# Altium schematic sheet Sheetpan(2)(2).SchDoc
size A2
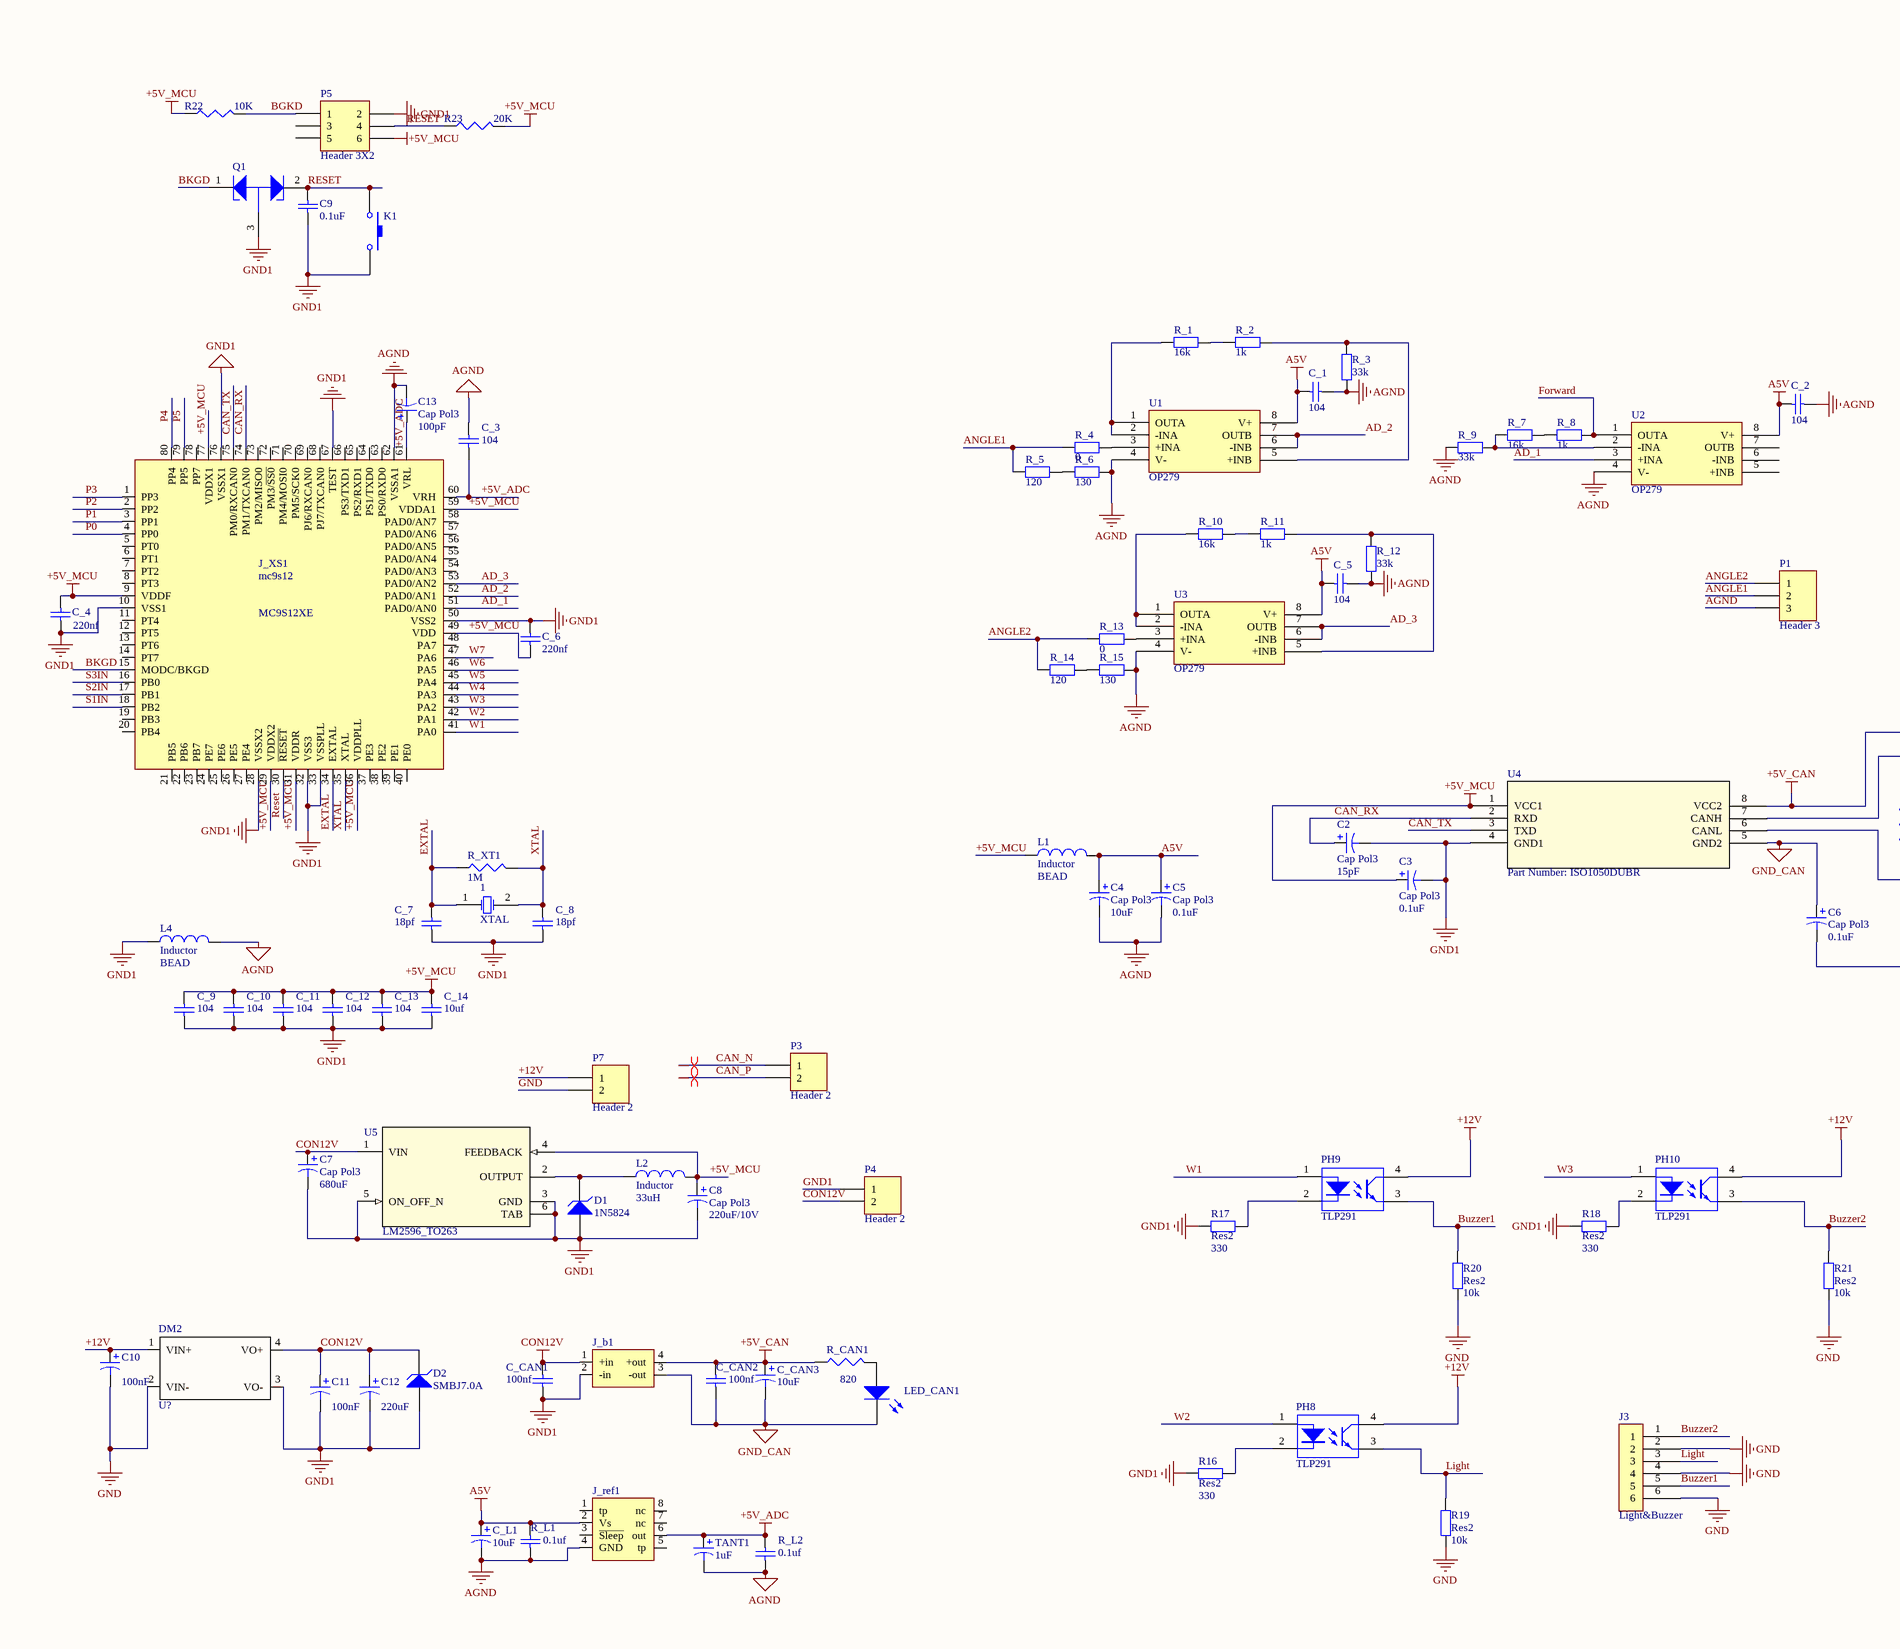
[diagram p0: Sheetpan(2)(2).SchDoc, left]
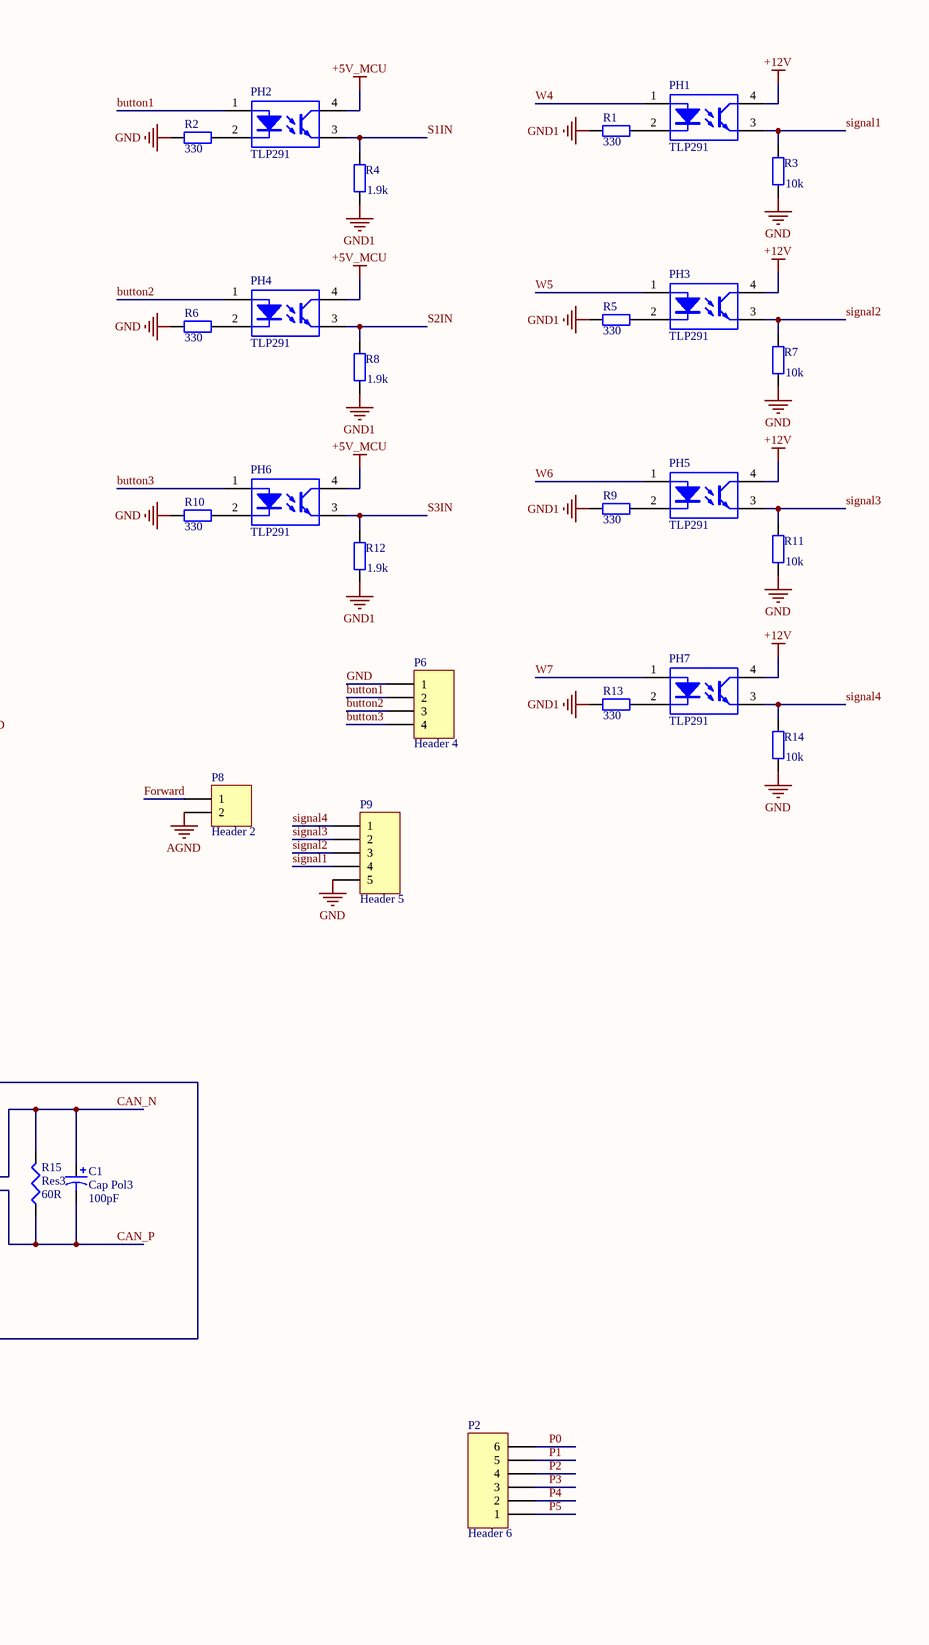
[diagram p1: Sheetpan(2)(2).SchDoc, right]

## Parts
1  XTAL  [CRYSTAL_SMD_FIRE]
C1  Cap Pol3  value 100pF  [0603C]
C2  Cap Pol3  value 15pF  [0603C]
C3  Cap Pol3  value 0.1uF  [0603C]
C4  Cap Pol3  value 10uF  [0603C]
C5  Cap Pol3  value 0.1uF  [0603C]
C6  Cap Pol3  value 0.1uF  [0603C]
C7  Cap Pol3  value 680uF  [0603C]
C8  Cap Pol3  value 220uF/10V  [TITANIUMCAPC6032]
C9  value 0.1uF  [0603C]  (hidden comment: Cap)
C10  value 100nF  [0603C]  (hidden comment: Cap Pol3)
C11  value 100nF  [0603C]  (hidden comment: Cap Pol3)
C12  value 220uF  [0603C]  (hidden comment: Cap Pol3)
C13  Cap Pol3  value 100pF  [0603C]
C_1  104  [0603C]
C_2  104  [0603C]
C_3  104  [0603C]
C_4  value 220nf  [0603C]  (hidden comment: 104)
C_5  104  [0603C]
C_6  value 220nf  [0603C]  (hidden comment: 104)
C_7  value 18pf  [0603C]  (hidden comment: 104)
C_8  value 18pf  [0603C]  (hidden comment: 104)
C_9  104  [0603C]
C_10  104  [0603C]
C_11  104  [0603C]
C_12  104  [0603C]
C_13  104  [0603C]
C_14  value 10uf  [0603C]  (hidden comment: 104)
C_CAN1  value 100nf  [0603C]  (hidden comment: 104)
C_CAN2  value 100nf  [0603C]  (hidden comment: 104)
C_CAN3  value 10uF  [0603C]  (hidden comment: Cap Pol1)
C_L1  value 10uF  [0603C]  (hidden comment: Cap Pol1)
D1  1N5824  [SMB]
D2  SMBJ7.0A  [SMB]
DM2  U?  [dcdc]
J3  Light&Buzzer  [KF2EDGK5.08-6P]
J_b1  b12s05  [PCBComponent_1_8]  (value not drawn)
J_ref1  ref195  [PCBComponent_1_13]  (value not drawn)
J_XS1  mc9s12  [PCBComponent_1_15]
K1  SW-PB  [KEY]  (value not drawn)
L1  Inductor  value BEAD  [0805]
L2  Inductor  value 33uH  [L1260]
L4  Inductor  value BEAD  [0805]
LED_CAN1  LED2  [PCBComponent_1_3]  (value not drawn)
P1  Header 3  [KF2EDGK5.08-3P]
P2  Header 6  [HDR1X6]
P3  Header 2  [KF2EDGK5.08-2P]
P4  Header 2  [KF2EDGK5.08-2P]
P5  Header 3X2  [HDR2X3]
P6  Header 4  [KF2EDGK5.08-4P]
P7  Header 2  [KF2EDGK5.08-2P]
P8  Header 2  [KF2EDGK5.08-2P]
P9  Header 5  [KF2EDGK5.08-5P]
PH1  TLP291  [SO4]
PH2  TLP291  [SO4]
PH3  TLP291  [SO4]
PH4  TLP291  [SO4]
PH5  TLP291  [SO4]
PH6  TLP291  [SO4]
PH7  TLP291  [SO4]
PH8  TLP291  [SO4]
PH9  TLP291  [SO4]
PH10  TLP291  [SO4]
Q1  6A8  [transistors]  (value not drawn)
R1  330  [0805]
R2  330  [0805]
R3  10k  [0805]
R4  1.9k  [0805]
R5  330  [0805]
R6  330  [0805]
R7  10k  [0805]
R8  1.9k  [0805]
R9  330  [0805]
R10  330  [0805]
R11  10k  [0805]
R12  1.9k  [0805]
R13  330  [0805]
R14  10k  [0805]
R15  Res3  value 60R  [0805]
R16  Res2  value 330  [0805]
R17  Res2  value 330  [0805]
R18  Res2  value 330  [0805]
R19  Res2  value 10k  [0805]
R20  Res2  value 10k  [0805]
R21  Res2  value 10k  [0805]
R22  value 10K  [0805]  (hidden comment: Res3)
R23  value 20K  [0805]  (hidden comment: Res3)
R_1  16k  [0805]
R_2  1k  [0805]
R_3  33k  [0805]
R_4  0  [0805]
R_5  120  [0805]
R_6  130  [0805]
R_7  16k  [0805]
R_8  1k  [0805]
R_9  33k  [0805]
R_10  16k  [0805]
R_11  1k  [0805]
R_12  33k  [0805]
R_13  0  [0805]
R_14  120  [0805]
R_15  130  [0805]
R_CAN1  value 820  [0805]  (hidden comment: Res3)
R_L1  value 0.1uf  [0603C]  (hidden comment: 104)
R_L2  value 0.1uf  [0603C]  (hidden comment: 104)
R_XT1  value 1M  [0805]  (hidden comment: Res3)
TANT1  value 1uF  [PCBComponent_1_19]  (hidden comment: Cap Pol1)
U1  OP279  [SOP8_M]
U2  OP279  [SOP8_M]
U3  OP279  [SOP8_M]
U4  Part Number: ISO1050DUBR  [DUB8]
U5  LM2596_TO263  [LM2596_TO263]

## Nets
+5V_ADC: C13.1 C_3.1 J_ref1.6(out) J_XS1.60(VRH) J_XS1.61(VRL) R_L2.2 TANT1.1
+5V_CAN: C6.2 C_CAN2.2 C_CAN3.1 J_b1.4(+out) R_CAN1.1 U4.8(VCC2)
+5V_MCU: C3.1 C8.1 C_4.1 C_6.2 C_9.2 C_10.2 C_11.2 C_12.2 C_13.2 C_14.2 J_XS1.9(VDDF) J_XS1.29(VDDX2) J_XS1.31(VDDR) J_XS1.36(VDDPLL) J_XS1.49(VDD) J_XS1.59(VDDA1) J_XS1.77(VDDX1) L1.1 L2.2 P5.6 PH2.4(C) PH4.4(C) PH6.4(C) R22.1 R23.2 U4.1(VCC1) U5.4(FEEDBACK)
+12V: C10.1 DM2.1(VIN+) P7.1 PH1.4(C) PH3.4(C) PH5.4(C) PH7.4(C) PH8.4(C) PH9.4(C) PH10.4(C)
A5V: C4.1 C5.1 C_1.1 C_2.1 C_5.1 C_L1.1 J_ref1.2(Vs) L1.2 R_L1.2 U1.8(V+) U2.8(V+) U3.8(V+)
AGND: C4.2 C5.2 C13.2 C_1.2 C_2.2 C_3.2 C_5.2 C_L1.2 J_ref1.4(GND) J_XS1.62(VSSA1) L4.2 P1.3 P8.2 R_3.1 R_6.2 R_9.1 R_12.1 R_15.2 R_L1.1 R_L2.1 TANT1.2 U1.4(V-) U2.4(V-) U3.4(V-)
CON12V: C7.1 C11.1 C12.1 C_CAN1.2 D2.2(K) DM2.4(VO+) J_b1.1(+in) P4.2 U5.1(VIN)
GND: C10.2 DM2.2(VIN-) J3.2 J3.4 J3.6 P6.1 P7.2 P9.5 R2.2 R3.1 R6.2 R7.1 R10.2 R11.1 R14.1 R19.1 R20.1 R21.1
GND1: C2.2 C3.2 C7.2 C8.2 C9.1 C11.2 C12.2 C_4.2 C_6.1 C_7.1 C_8.1 C_9.1 C_10.1 C_11.1 C_12.1 C_13.1 C_14.1 C_CAN1.1 D1.1(A) D2.1(A) DM2.3(VO-) J_b1.2(-in) J_XS1.10(VSS1) J_XS1.28(VSSX2) J_XS1.32(VSS3) J_XS1.33(VSSPLL) J_XS1.50(VSS2) J_XS1.67(TEST) J_XS1.76(VSSX1) K1.2 L4.1 P4.1 P5.2 Q1.3(C) R1.2 R4.1 R5.2 R8.1 R9.2 R12.1 R13.2 R16.1 R17.1 R18.1 U4.4(GND1) U5.3(GND) U5.5(ON_OFF_N) U5.6(TAB)
GND_CAN: C6.1 C_CAN2.1 C_CAN3.2 J_b1.3(-out) LED_CAN1.2(K) U4.5(GND2)
AD_1: J_XS1.51(PAD0/AN0) U2.3(+INA)
AD_2: J_XS1.52(PAD0/AN1) U1.6(-INB) U1.7(OUTB)
AD_3: J_XS1.53(PAD0/AN2) U3.6(-INB) U3.7(OUTB)
ANGLE1: P1.2 R_4.1 R_5.1
ANGLE2: P1.1 R_13.1 R_14.1
BGKD: P5.1 R22.2
BKGD: J_XS1.15(MODC/BKGD) Q1.1(B)
button1: P6.2 PH2.1(A)
button2: P6.3 PH4.1(A)
button3: P6.4 PH6.1(A)
Buzzer1: J3.5 PH9.3(E) R20.2
Buzzer2: J3.1 PH10.3(E) R21.2
CAN_N: C1.1 P3.1 R15.2 U4.7(CANH)
CAN_P: C1.2 P3.2 R15.1 U4.6(CANL)
CAN_RX: C2.1 J_XS1.74(PM1/TXCAN0) U4.2(RXD)
CAN_TX: J_XS1.75(PM0/RXCAN0) U4.3(TXD)
EXTAL: 1.1(OSC1) C_7.2 J_XS1.34(EXTAL) R_XT1.1
Forward: P8.1 R_8.2 U2.1(OUTA)
Light: J3.3 PH8.3(E) R19.2
P0: J_XS1.4(PP0) P2.6
P1: J_XS1.3(PP1) P2.5
P2: J_XS1.2(PP2) P2.4
P3: J_XS1.1(PP3) P2.3
P4: J_XS1.80(PP4) P2.2
P5: J_XS1.79(PP5) P2.1
Reset: C9.2 J_XS1.30(~{RESET}) K1.1 P5.4 Q1.2(E) R23.1
S1IN: J_XS1.18(PB2) PH2.3(E) R4.2
S2IN: J_XS1.17(PB1) PH4.3(E) R8.2
S3IN: J_XS1.16(PB0) PH6.3(E) R12.2
signal1: P9.4 PH1.3(E) R3.2
signal2: P9.3 PH3.3(E) R7.2
signal3: P9.2 PH5.3(E) R11.2
signal4: P9.1 PH7.3(E) R14.2
W1: J_XS1.41(PA0) PH9.1(A)
W2: J_XS1.42(PA1) PH8.1(A)
W3: J_XS1.43(PA2) PH10.1(A)
W4: J_XS1.44(PA3) PH1.1(A)
W5: J_XS1.45(PA4) PH3.1(A)
W6: J_XS1.46(PA5) PH5.1(A)
W7: J_XS1.47(PA6) PH7.1(A)
XTAL: 1.2(OSC2) C_8.2 J_XS1.35(XTAL) R_XT1.2
NetD1_2: D1.2(K) L2.1 U5.2(OUTPUT)
NetLED_CAN1_1: LED_CAN1.1(A) R_CAN1.2
NetPH1_2: PH1.2(K) R1.1
NetPH2_2: PH2.2(K) R2.1
NetPH3_2: PH3.2(K) R5.1
NetPH4_2: PH4.2(K) R6.1
NetPH5_2: PH5.2(K) R9.1
NetPH6_2: PH6.2(K) R10.1
NetPH7_2: PH7.2(K) R13.1
NetPH8_2: PH8.2(K) R16.2
NetPH9_2: PH9.2(K) R17.2
NetPH10_2: PH10.2(K) R18.2
NetR_1_1: R_1.1 U1.1(OUTA) U1.2(-INA)
NetR_1_2: R_1.2 R_2.1
NetR_2_2: R_2.2 R_3.2 U1.5(+INB)
NetR_4_2: R_4.2 U1.3(+INA)
NetR_5_2: R_5.2 R_6.1
NetR_7_1: R_7.1 R_9.2 U2.2(-INA)
NetR_7_2: R_7.2 R_8.1
NetR_10_1: R_10.1 U3.1(OUTA) U3.2(-INA)
NetR_10_2: R_10.2 R_11.1
NetR_11_2: R_11.2 R_12.2 U3.5(+INB)
NetR_13_2: R_13.2 U3.3(+INA)
NetR_14_2: R_14.2 R_15.1

Not connected (* = marked no-connect by the designer): J_ref1 1(tp) 3(~{Sleep}) 5(tp) 7(nc) 8(nc); J_XS1 5(PT0) 6(PT1) 7(PT2) 8(PT3) 11(PT4) 12(PT5) 13(PT6) 14(PT7) 19(PB3) 20(PB4) 21(PB5) 22(PB6) 23(PB7) 24(PE7) 25(PE6) 26(PE5) 27(PE4) 37(PE3) 38(PE2) 39(PE1) 40(PE0) 48(PA7) 54(PAD0/AN3) 55(PAD0/AN4) 56(PAD0/AN5) 57(PAD0/AN6) 58(PAD0/AN7) 63(PS0/RXD0) 64(PS1/TXD0) 65(PS2/RXD1) 66(PS3/TXD1) 68(PJ7/TXCAN0) 69(PJ6/RXCAN0) 70(PM5/SCK0) 71(PM4/MOSI0) 72(PM3/~{SS0}) 73(PM2/MISO0) 78(PP7); P5 3 5; U2 5(+INB) 6(-INB) 7(OUTB)

## Layout directives
differential pair: CAN_N, CAN_P

## Notes on the sheet
- (in symbol mc9s12) MC9S12XE

## Library data of the parts
1 = XTAL: Crystal Oscillator; Published: 8-Jun-2000; LatestRevisionDate: 17-Jul-2002; LatestRevisionNote: Re-released for DXP Platform.; PackageReference: R38; Publisher: Altium Limited
C1-C8 C10-C13 = Cap Pol3: Polarized Capacitor (Surface Mount); Published: 8-Jun-2000; LatestRevisionDate: 29-May-2009; LatestRevisionNote: IPC-7351 Footprint Added.; PackageReference: C0805; Publisher: Altium Limited; PackageDescription: Chip Capacitor
C9 = Cap: Ceramic, X7R, 100V, 10%, 0603; Published: 8-Jun-2000; LatestRevisionDate: 17-Jul-2002; LatestRevisionNote: Re-released for DXP Platform.; PackageReference: RAD-0.3; Publisher: Altium Limited; PackageDescription: Radial Cap, Thru-Hole; 2 Leads; 0.3 in Pin Spacing
C_1-C_14 C_CAN1 C_CAN2 R_L1 R_L2 = Cap: Capacitor; Published: 8-Jun-2000; LatestRevisionDate: 17-Jul-2002; LatestRevisionNote: Re-released for DXP Platform.; PackageReference: RAD-0.3; Publisher: Altium Limited
  C_1-C_3 C_5 C_9-C_13: VALUE: 104
C_CAN3 C_L1 TANT1 = Cap Pol1: Polarized Capacitor (Radial); Published: 8-Jun-2000; LatestRevisionDate: 17-Jul-2002; LatestRevisionNote: Re-released for DXP Platform.; PackageReference: RB7.6-15; Publisher: Altium Limited
D1 D2 = D Zener: Zener Diode; Published: 8-Jun-2000; LatestRevisionDate: 17-Jul-2002; LatestRevisionNote: Re-released for DXP Platform.; PackageReference: DIODE-0.7; Publisher: Altium Limited; PackageDescription: Diode, Thru-Hole; 2 Leads; 0.7 in Pin Spacing
DM2 = Component_1
J3 = HAD1*6
K1 = SW-PB: Switch; Published: 24-Mar-1999; LatestRevisionDate: 17-Jul-2002; LatestRevisionNote: Re-released for DXP Platform.; PackageReference: SPST-2; Publisher: Altium Limited; PackageDescription: Switch; 2 Leads
L1 L2 L4 = Inductor: Code_IEC: 1005; Published: 8-Jun-2000; LatestRevisionDate: 29-May-2009; LatestRevisionNote: IPC-7351 Footprint Added.; PackageReference: 0402-A; Publisher: Altium Limited; PackageDescription: Chip Inductor; Code_JEITA: 0402
LED_CAN1 = LED2: Typical RED, GREEN, YELLOW, AMBER GaAs LED; Published: 8-Jun-2000; LatestRevisionDate: 17-Jul-2002; LatestRevisionNote: Re-released for DXP Platform.; PackageVersion: Feb-2002; PackageReference: 3.2X1.6X1.1; Publisher: Altium Limited
P1 = Header 3: Header, 3-Pin; LatestRevisionDate: 17-Jul-2002; LatestRevisionNote: Re-released for DXP Platform.; Publisher: Altium Limited
P2 = Header 6: Header, 6-Pin; LatestRevisionDate: 17-Jul-2002; LatestRevisionNote: Re-released for DXP Platform.; Publisher: Altium Limited
P3 P4 P7 P8 = Header 2: Header, 2-Pin; LatestRevisionDate: 17-Jul-2002; LatestRevisionNote: Re-released for DXP Platform.; Publisher: Altium Limited
P5 = Header 3X2: Header, 3-Pin, Dual row; LatestRevisionDate: 17-Jul-2002; LatestRevisionNote: Re-released for DXP Platform.; Publisher: Altium Limited
P6 = Header 4: Header, 4-Pin; LatestRevisionDate: 17-Jul-2002; LatestRevisionNote: Re-released for DXP Platform.; Publisher: Altium Limited
P9 = Header 5: Header, 5-Pin; LatestRevisionDate: 17-Jul-2002; LatestRevisionNote: Re-released for DXP Platform.; Publisher: Altium Limited
PH1-PH10 = TLP291: Optoisolator
R1-R14 R_1-R_15 = RES: Resistor
R15 R22 R23 R_CAN1 R_XT1 = Res3: Resistor; Published: 8-Jun-2000; LatestRevisionDate: 29-May-2009; LatestRevisionNote: IPC-7351 Footprint Added.; PackageReference: J1-0603; Publisher: Altium Limited; PackageDescription: Chip Resistor
R16-R21 = Res2: Resistor; Published: 8-Jun-2000; LatestRevisionDate: 17-Jul-2002; LatestRevisionNote: Re-released for DXP Platform.; PackageReference: AXIAL-0.4; Publisher: Altium Limited; PackageDescription: Axial Device, Thru-Hole; 2 Leads; 0.4 in Pin Spacing
U4 = ISO1050DUBR: No Description Available; Manufacturer: Texas Instruments; Built_By: EMA_UL_Team; Vendor: Texas Instruments; Manufacturer_Part_Number: ISO1050DUBR; Copyright: Copyright (C) 2018 Accelerated Designs. All rights reserved; RefDes: RefDes; Type: DEV; Value: Value